# Altium schematic sheet ThermocoupleCircuit.SchDoc: Set in Document Options » Parameters » Title
size Tabloid; Author: Set in Document Options » Parameters » Author + Contact info
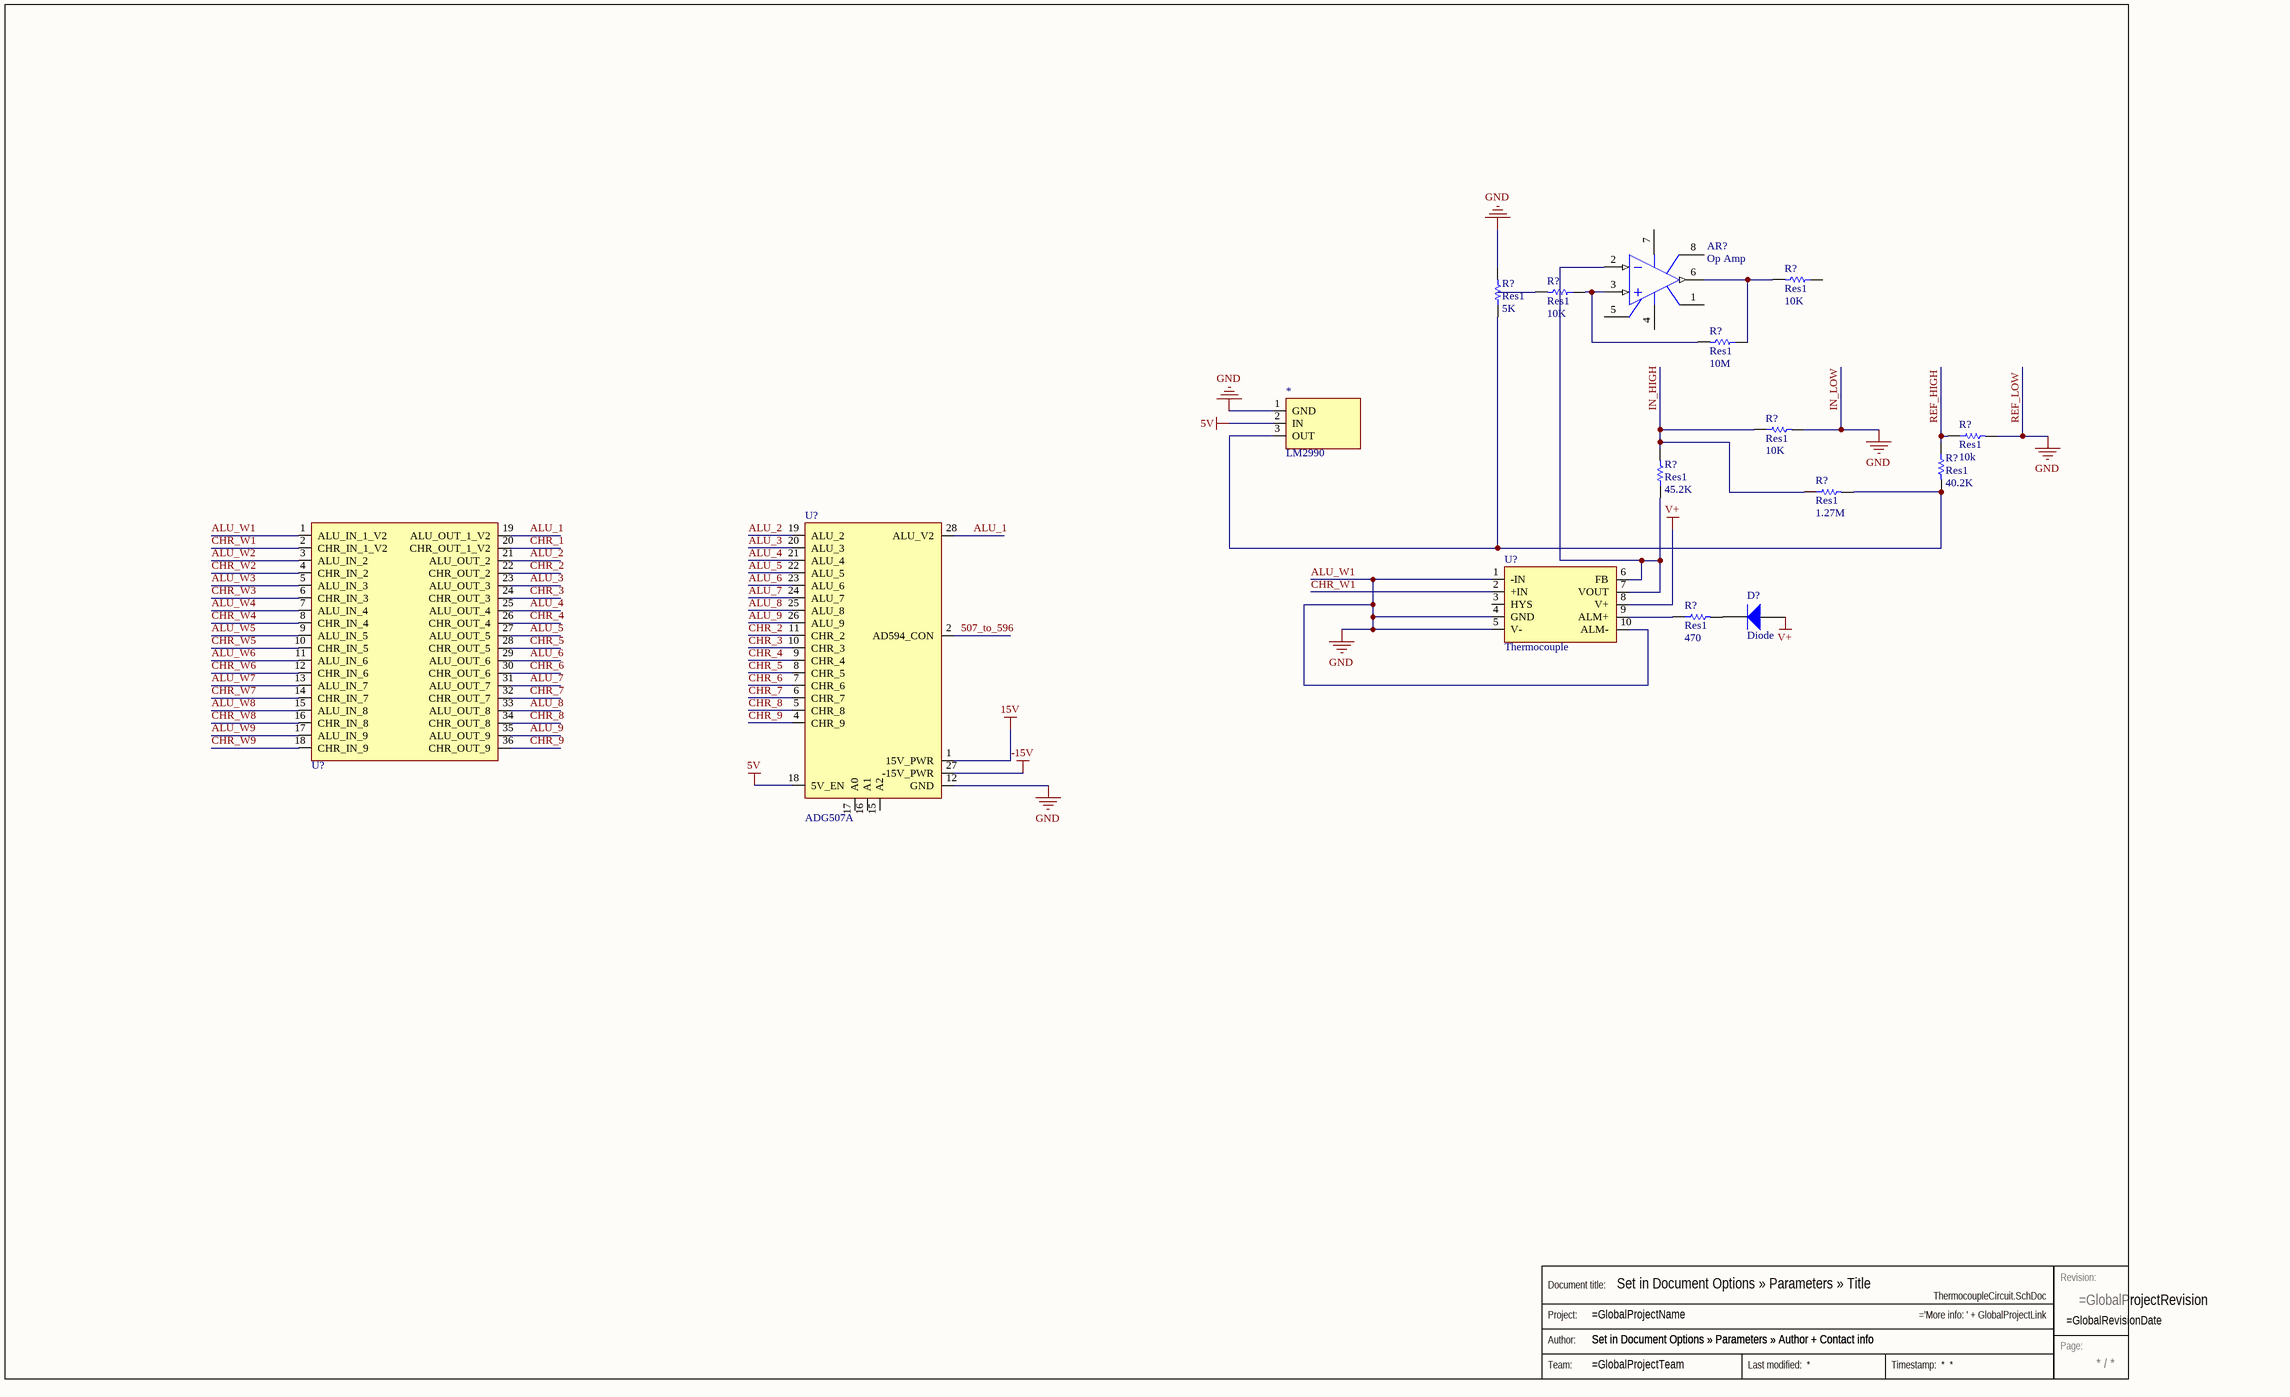
[diagram p0: ThermocoupleCircuit.SchDoc]

## Parts
(Parts that share a designator on the sheet are numbered #1, #2 ... from top to bottom, then left to right.)
*  LM2990  [LM2990]
AR?  Op Amp  [H-08A]
D?  Diode  [SMC]
R?#1  Res1  value 10K  [AXIAL-0.3]
R?#2  Res1  value 5K  [AXIAL-0.3]
R?#3  Res1  value 10K  [AXIAL-0.3]
R?#4  Res1  value 10M  [AXIAL-0.3]
R?#5  Res1  value 10K  [AXIAL-0.3]
R?#6  Res1  value 10k  [AXIAL-0.3]
R?#7  Res1  value 40.2K  [AXIAL-0.3]
R?#8  Res1  value 1.27M  [AXIAL-0.3]
R?#9  Res1  value 45.2K  [AXIAL-0.3]
R?#10  Res1  value 470  [AXIAL-0.3]
Stamp  Stamp  (value not drawn)  (graphical)
U?#1  ADG507A  [ADG507a]
U?#2  Thermocouple  [SOIC127P600X175-8N]
U?#3  Isothermal Block  (value not drawn)

## Nets
5V: *.2(IN) U?#1.18(5V_EN)
15V: U?#1.1(15V_PWR)
-15V: U?#1.27(-15V_PWR)
ALU_W1: *.1(GND) R?#2.2 R?#5.2 R?#6.2 U?#1.12(GND) U?#2.1(-IN) U?#2.4(GND) U?#2.5(V-) U?#2.10(ALM-) U?#3.1(ALU_IN_1_V2)  [also labelled GND, IN_LOW, REF_LOW]
V+: D?.1(A) U?#2.8(V+)
507_to_596: U?#1.2(AD594_CON)
ALU_1: U?#1.28(ALU_V2) U?#3.19(ALU_OUT_1_V2)
ALU_2: U?#1.19(ALU_2) U?#3.21(ALU_OUT_2)
ALU_3: U?#1.20(ALU_3) U?#3.23(ALU_OUT_3)
ALU_4: U?#1.21(ALU_4) U?#3.25(ALU_OUT_4)
ALU_5: U?#1.22(ALU_5) U?#3.27(ALU_OUT_5)
ALU_6: U?#1.23(ALU_6) U?#3.29(ALU_OUT_6)
ALU_7: U?#1.24(ALU_7) U?#3.31(ALU_OUT_7)
ALU_8: U?#1.25(ALU_8) U?#3.33(ALU_OUT_8)
ALU_9: U?#1.26(ALU_9) U?#3.35(ALU_OUT_9)
ALU_W2: U?#3.3(ALU_IN_2)
ALU_W3: U?#3.5(ALU_IN_3)
ALU_W4: U?#3.7(ALU_IN_4)
ALU_W5: U?#3.9(ALU_IN_5)
ALU_W6: U?#3.11(ALU_IN_6)
ALU_W7: U?#3.13(ALU_IN_7)
ALU_W8: U?#3.15(ALU_IN_8)
ALU_W9: U?#3.17(ALU_IN_9)
CHR_1: U?#3.20(CHR_OUT_1_V2)
CHR_2: U?#1.11(CHR_2) U?#3.22(CHR_OUT_2)
CHR_3: U?#1.10(CHR_3) U?#3.24(CHR_OUT_3)
CHR_4: U?#1.9(CHR_4) U?#3.26(CHR_OUT_4)
CHR_5: U?#1.8(CHR_5) U?#3.28(CHR_OUT_5)
CHR_6: U?#1.7(CHR_6) U?#3.30(CHR_OUT_6)
CHR_7: U?#1.6(CHR_7) U?#3.32(CHR_OUT_7)
CHR_8: U?#1.5(CHR_8) U?#3.34(CHR_OUT_8)
CHR_9: U?#1.4(CHR_9) U?#3.36(CHR_OUT_9)
CHR_W1: U?#2.2(+IN) U?#3.2(CHR_IN_1_V2)
CHR_W2: U?#3.4(CHR_IN_2)
CHR_W3: U?#3.6(CHR_IN_3)
CHR_W4: U?#3.8(CHR_IN_4)
CHR_W5: U?#3.10(CHR_IN_5)
CHR_W6: U?#3.12(CHR_IN_6)
CHR_W7: U?#3.14(CHR_IN_7)
CHR_W8: U?#3.16(CHR_IN_8)
CHR_W9: U?#3.18(CHR_IN_9)
IN_HIGH: R?#5.1 R?#8.1 R?#9.2
REF_HIGH: R?#6.1 R?#7.1
Net*_3: *.3(OUT) R?#2.1 R?#7.2 R?#8.2
NetAR?_2: AR?.2(IN-) R?#9.1 U?#2.6(FB) U?#2.7(VOUT)
NetAR?_3: AR?.3(IN+) R?#3.1 R?#4.2
NetAR?_6: AR?.6(OUT) R?#1.2 R?#4.1
NetD?_2: D?.2(K) R?#10.2
NetR?#10_1: R?#10.1 U?#2.9(ALM+)

Not connected (* = marked no-connect by the designer): AR? 1(OS_NUL) 4(V-) 5(OS_NUL) 7(V+) 8(TAB); R?#1 1; R?#3 2; U?#1 15(A2) 16(A1) 17(A0); U?#2 3(HYS)

## Notes on the sheet
- (in symbol Stamp) Revision:; Document title:; Project:; Author:; Page:; Team:

## Library data of the parts
AR? = Op Amp: FET Operational Amplifier; Published: 8-Jun-2000; LatestRevisionDate: 17-Jul-2002; LatestRevisionNote: Re-released for DXP Platform.; DatasheetVersion: REV. B; PackageVersion: 1990; PackageReference: H-08A; Publisher: Altium Limited; PackageDescription: Can; 8 Leads; Pin Circle Dia. 5.08 mm; Lead Dia. 0.53 mm (max); ComponentLink1Description: Manufacturer Link; ComponentLink1URL: http://www.analog.com/
D? = Diode: Default Diode; Published: 8-Jun-2000; LatestRevisionDate: 17-Jul-2002; LatestRevisionNote: Re-released for DXP Platform.; PackageVersion: Sep-1996; PackageReference: SMC; Publisher: Altium Limited; PackageDescription: DO-214-AB/SMC; 2 C-Bend Leads; Body 7.9 x 5.9 mm, inc. leads (LxW); Code_JEDEC: DO-214-AB
R?#1-R?#10 = Res1: Resistor; Published: 8-Jun-2000; LatestRevisionDate: 17-Jul-2002; LatestRevisionNote: Re-released for DXP Platform.; PackageReference: AXIAL-0.3; Publisher: Altium Limited; PackageDescription: Axial Device, Thru-Hole; 2 Leads; 0.3 in Pin Spacing
U?#1 = ADG507A: MUX Input
U?#2 = AD596/597